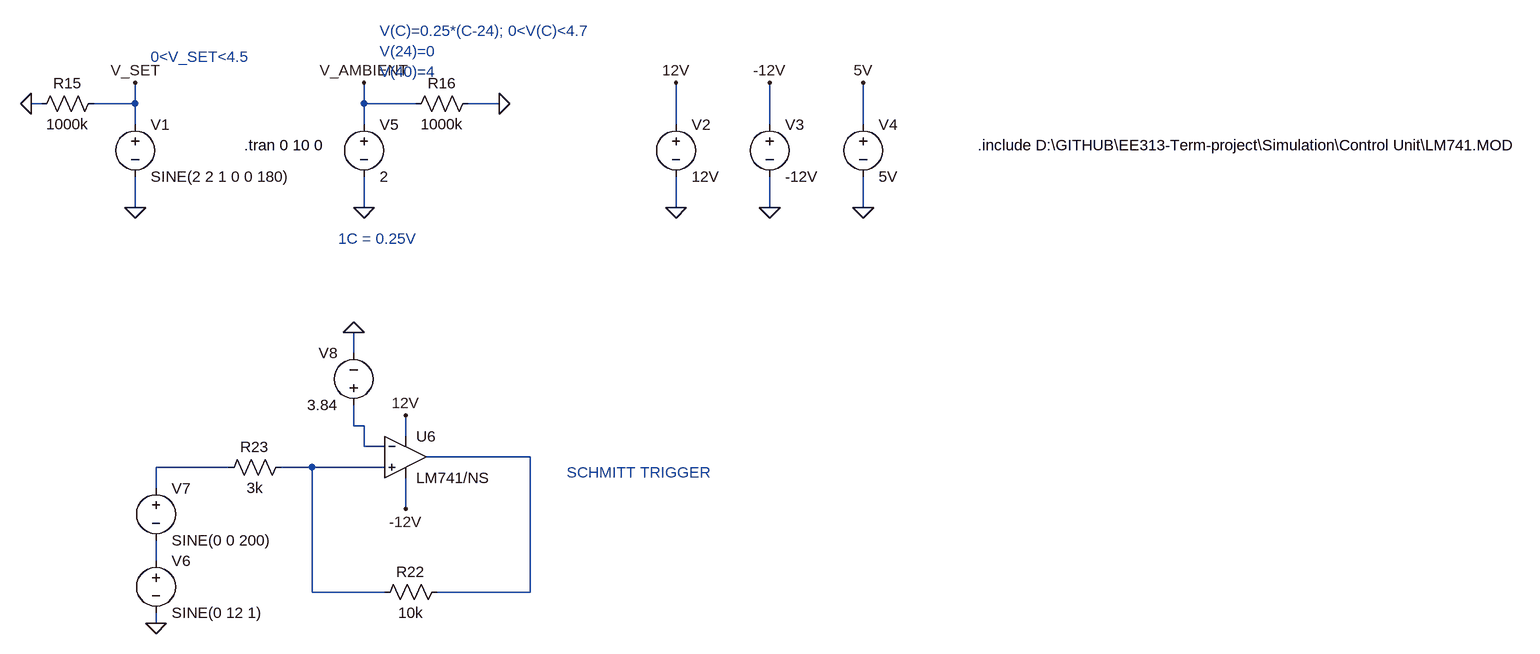
[diagram p0: schematic Control Unit.asc]
Control Unit.asc, the LTspice schematic file:
Version 4
SHEET 1 4272 2960
WIRE -1232 -512 -1248 -512
WIRE -1088 -512 -1088 -544
WIRE -1088 -512 -1152 -512
WIRE -736 -512 -736 -544
WIRE -656 -512 -736 -512
WIRE -528 -512 -576 -512
WIRE -1088 -480 -1088 -512
WIRE -736 -480 -736 -512
WIRE -256 -480 -256 -544
WIRE -112 -480 -112 -544
WIRE 32 -480 32 -544
WIRE -1088 -352 -1088 -400
WIRE -736 -352 -736 -400
WIRE -256 -352 -256 -400
WIRE -112 -352 -112 -400
WIRE 32 -352 32 -400
WIRE -752 -128 -752 -160
WIRE -752 -16 -752 -48
WIRE -736 -16 -752 -16
WIRE -672 0 -672 -32
WIRE -736 16 -736 -16
WIRE -704 16 -736 16
WIRE -480 32 -640 32
WIRE -944 48 -1056 48
WIRE -816 48 -864 48
WIRE -704 48 -816 48
WIRE -1056 80 -1056 48
WIRE -672 112 -672 64
WIRE -1056 192 -1056 160
WIRE -816 240 -816 48
WIRE -704 240 -816 240
WIRE -480 240 -480 32
WIRE -480 240 -624 240
WIRE -1056 288 -1056 272
FLAG -1088 -352 0
FLAG -1088 -544 V_SET
FLAG -256 -352 0
FLAG -256 -544 12V
FLAG -112 -352 0
FLAG -112 -544 -12V
FLAG 32 -352 0
FLAG 32 -544 5V
FLAG -736 -352 0
FLAG -736 -544 V_AMBIENT
FLAG -528 -512 0
FLAG -1248 -512 0
FLAG -672 -32 12V
FLAG -672 112 -12V
FLAG -1056 288 0
FLAG -752 -160 0
SYMBOL voltage -1088 -496 R0
WINDOW 123 0 0 Left 0
WINDOW 39 0 0 Left 0
SYMATTR InstName V1
SYMATTR Value SINE(2 2 1 0 0 180)
SYMBOL voltage -256 -496 R0
WINDOW 123 0 0 Left 0
WINDOW 39 0 0 Left 0
SYMATTR InstName V2
SYMATTR Value 12V
SYMBOL voltage -112 -496 R0
WINDOW 123 0 0 Left 0
WINDOW 39 0 0 Left 0
SYMATTR InstName V3
SYMATTR Value -12V
SYMBOL voltage 32 -496 R0
WINDOW 123 0 0 Left 0
WINDOW 39 0 0 Left 0
SYMATTR InstName V4
SYMATTR Value 5V
SYMBOL voltage -736 -496 R0
WINDOW 123 0 0 Left 0
WINDOW 39 0 0 Left 0
SYMATTR InstName V5
SYMATTR Value 2
SYMBOL res -1136 -528 R90
WINDOW 0 0 56 VBottom 2
WINDOW 3 32 56 VTop 2
SYMATTR InstName R15
SYMATTR Value 1000k
SYMBOL res -560 -528 R90
WINDOW 0 0 56 VBottom 2
WINDOW 3 32 56 VTop 2
SYMATTR InstName R16
SYMATTR Value 1000k
SYMBOL OpAmps\\opamp2 -672 -32 R0
SYMATTR InstName U6
SYMATTR Value LM741/NS
SYMBOL res -608 224 R90
WINDOW 0 0 56 VBottom 2
WINDOW 3 32 56 VTop 2
SYMATTR InstName R22
SYMATTR Value 10k
SYMBOL res -848 32 R90
WINDOW 0 0 56 VBottom 2
WINDOW 3 32 56 VTop 2
SYMATTR InstName R23
SYMATTR Value 3k
SYMBOL voltage -1056 176 R0
WINDOW 123 0 0 Left 0
WINDOW 39 0 0 Left 0
SYMATTR InstName V6
SYMATTR Value SINE(0 12 1)
SYMBOL voltage -1056 64 R0
WINDOW 123 0 0 Left 0
WINDOW 39 0 0 Left 0
SYMATTR InstName V7
SYMATTR Value SINE(0 0 200)
SYMBOL voltage -752 -32 R180
WINDOW 0 24 96 Left 2
WINDOW 3 24 16 Left 2
WINDOW 123 0 0 Left 0
WINDOW 39 0 0 Left 0
SYMATTR InstName V8
SYMATTR Value 3.84
TEXT 208 -448 Left 2 !.include D:\\GITHUB\\EE313-Term-project\\Simulation\\Control Unit\\LM741.MOD
TEXT -920 -448 Left 2 !.tran 0 10 0
TEXT -712 -624 Left 2 ;V(C)=0.25*(C-24); 0<V(C)<4.7\nV(24)=0\nV(40)=4
TEXT -1064 -584 Left 2 ;0<V_SET<4.5
TEXT -776 -304 Left 2 ;1C = 0.25V
TEXT -424 56 Left 2 ;SCHMITT TRIGGER

The netlist it stands for:
* Control Unit.asc
V1 V_SET 0 SINE(2 2 1 0 0 180)
V2 12V 0 12V
V3 -12V 0 -12V
V4 5V 0 5V
V5 V_AMBIENT 0 2
R15 V_SET 0 1000k
R16 0 V_AMBIENT 1000k
XU6 N004 N001 12V -12V N002 LM741/NS  ; pins In+ In- V+ V- OUT
R22 N002 N004 10k
R23 N004 N003 3k
V6 N005 0 SINE(0 12 1)
V7 N003 N005 SINE(0 0 200)
V8 N001 0 3.84
.include D:\GITHUB\EE313-Term-project\Simulation\Control Unit\LM741.MOD
.tran 0 10 0
* V(C)=0.25*(C-24); 0<V(C)<4.7
* V(24)=0
* V(40)=4
* 0<V_SET<4.5
* 1C = 0.25V
* SCHMITT TRIGGER
.backanno
.end